# Altium schematic sheet BLOCK DIAGRAM.SchDoc
size A3; SheetNumber: 3; SheetTotal: 5
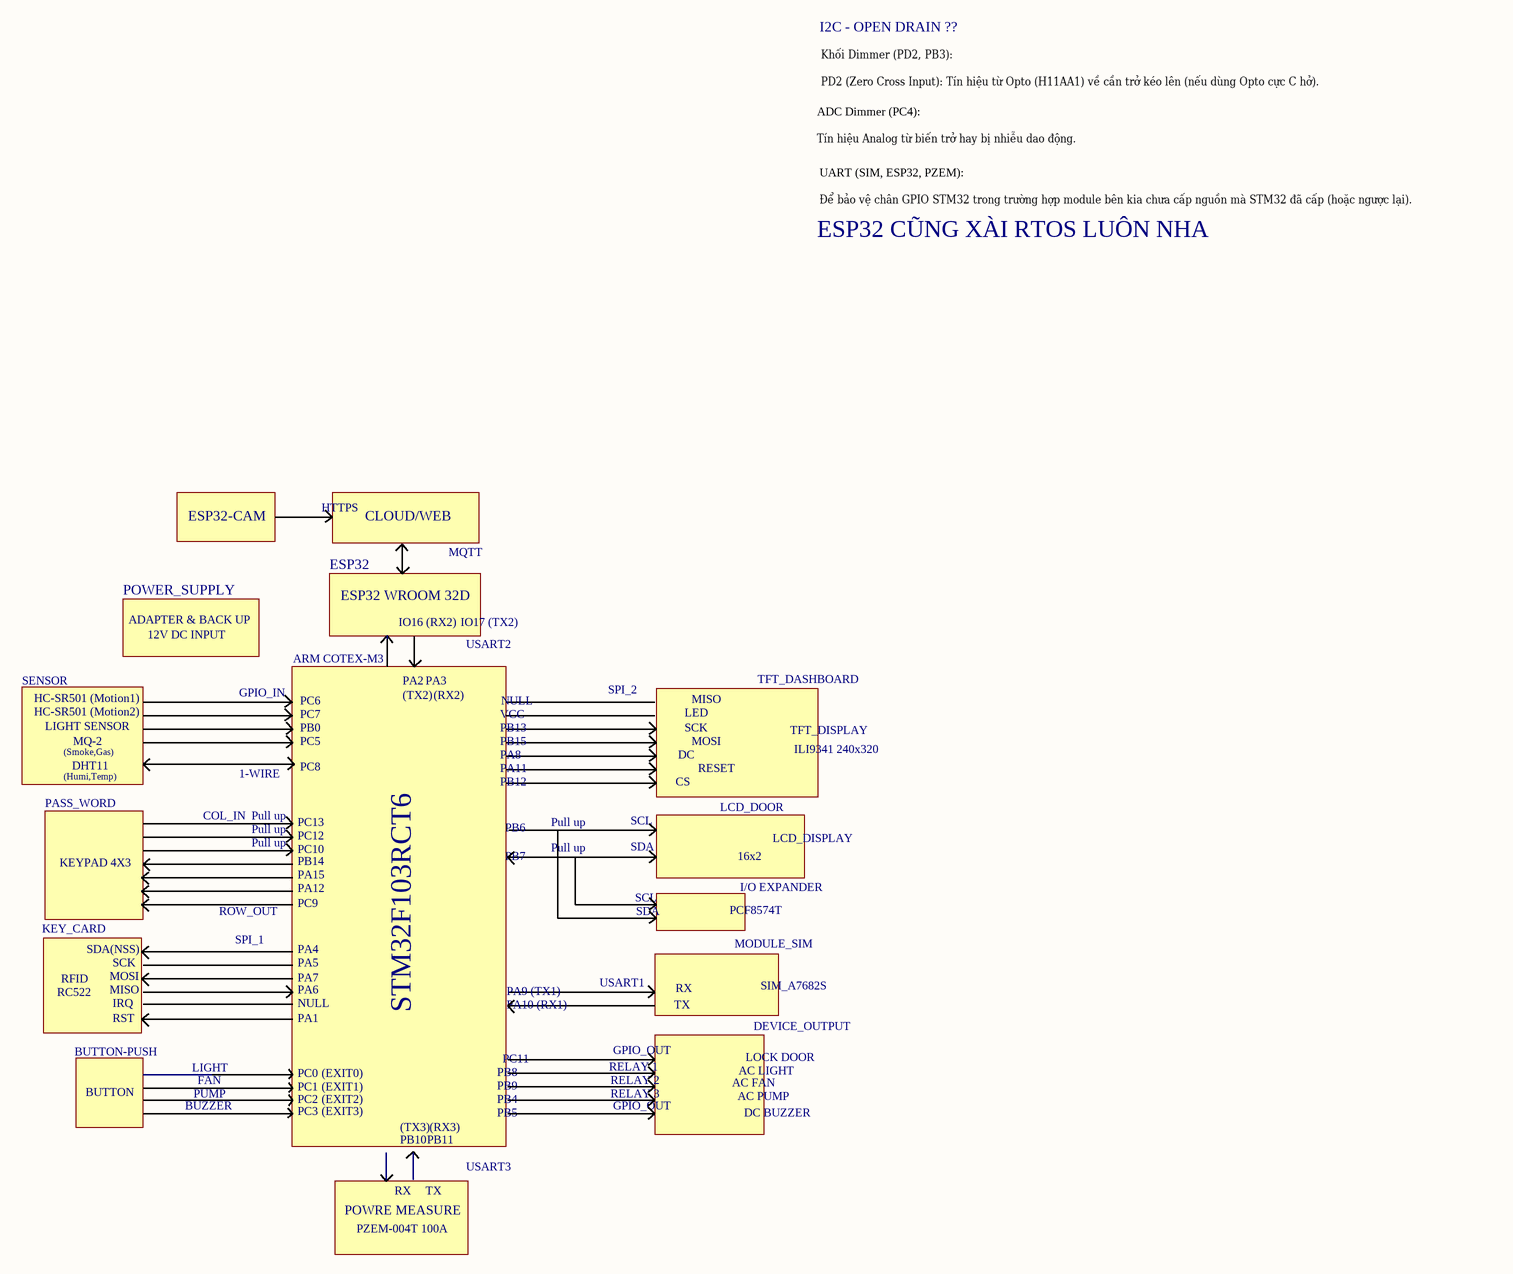
[diagram p0: BLOCK DIAGRAM.SchDoc]

## Notes on the sheet
- I2C - OPEN DRAIN ??
- Khối Dimmer (PD2, PB3):
  PD2 (Zero Cross Input): Tín hiệu từ Opto (H11AA1) về cần trở kéo lên (nếu dùng Opto cực C hở). 👉 Thêm trở 10kΩ kéo lên 3.3V.
  PB3 (Triac Output): Kích vào Opto triac (MOC3021). 👉 Thêm trở hạn dòng 330Ω - 470Ω nối tiếp.
- ADC Dimmer (PC4):
  Tín hiệu Analog từ biến trở hay bị nhiễu dao động.
  👉 Thêm: 1 tụ gốm 100nF nối từ chân PC4 xuống GND (ngay sát chân chip) để làm mượt giá trị đọc.
- ESP32 CŨNG XÀI RTOS LUÔN NHA
- UART (SIM, ESP32, PZEM):
  Để bảo vệ chân GPIO STM32 trong trường hợp module bên kia chưa cấp nguồn mà STM32 đã cấp (hoặc ngược lại).
  👉 Thêm: Mắc nối tiếp điện trở 1kΩ trên các đường TX và RX. (Ví dụ: STM32_TX --[1k]-- ESP32_RX).
- ESP32-CAM
- HTTPS
- CLOUD/WEB
- POWER_SUPPLY
- ESP32
- ESP32 WROOM 32D
- MQTT
- ADAPTER & BACK UP
- 12V DC INPUT
- ARM COTEX-M3
- IO16 (RX2)
- IO17 (TX2)
- USART2
- SENSOR
- HC-SR501 (Motion1)
- HC-SR501 (Motion2)
- LIGHT SENSOR
- GPIO_IN
- PC6
- PC7
- PB0
- PA2
- (TX2)
- PA3
- (RX2)
- PB13
- VCC
- NULL
- SPI_2
- SCK
- LED
- MISO
- TFT_DASHBOARD
- TFT_DISPLAY
- (Humi,Temp)
- (Smoke,Gas)
- DHT11
- MQ-2
- 1-WIRE
- PC5
- PC8
- PB12
- PA11
- PA8
- PB15
- CS
- DC
- MOSI
- RESET
- ILI9341 240x320
- PASS_WORD
- KEYPAD 4X3
- COL_IN
- Pull up
- PC13
- PC12
- PC10
- PB14
- PB6
- PB7
- SCL
- SDA
- LCD_DOOR
- 16x2
- LCD_DISPLAY
- KEY_CARD
- ROW_OUT
- PA15
- PA12
- PC9
- PCF8574T
- I/O EXPANDER
- RC522
- RFID
- SDA(NSS)
- IRQ
- SPI_1
- PA5
- PA4
- PA7
- PA6
- STM32F103RCT6
- PA9 (TX1)
- PA10 (RX1)
- USART1
- TX
- RX
- MODULE_SIM
- SIM_A7682S
- BUTTON-PUSH
- RST
- LIGHT
- PA1
- PC11
- RELAY 1
- GPIO_OUT
- AC LIGHT
- LOCK DOOR
- DEVICE_OUTPUT
- BUTTON
- BUZZER
- PUMP
- FAN
- PC0
- PC1
- PC2
- PC3
- (EXIT0)
- (EXIT1)
- (EXIT2)
- (EXIT3)
- PB10
- (TX3)
- PB11
- (RX3)
- PB8
- PB9
- PB4
- PB5
- RELAY 2
- RELAY 3
- AC FAN
- AC PUMP
- DC BUZZER
- USART3
- POWRE MEASURE
- PZEM-004T 100A
- Title:
- Desc:
- Designed by:
- Checked by:
- Date:
- Document No:
- Revision:
- Size:
- A3
- Approved by:
- Sheet
- of